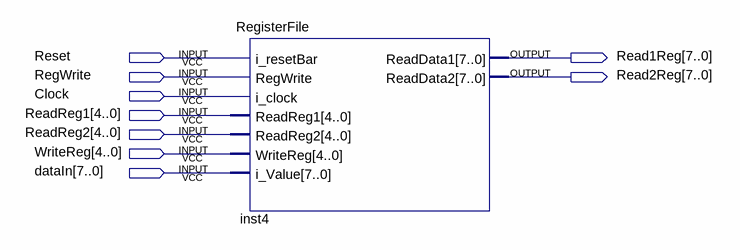
[diagram p0: schematic sheet]
// Quartus schematic test.bdf as structural Verilog: 1 symbols, 9 pins
module test (
  input  Reset,
  input  RegWrite,
  input  Clock,
  input  [4:0] ReadReg1,
  input  [4:0] ReadReg2,
  input  [4:0] WriteReg,
  input  [7:0] dataIn,
  output [7:0] Read1Reg,
  output [7:0] Read2Reg
);

  RegisterFile inst4 (
    .i_resetBar(Reset), .RegWrite(RegWrite), .i_clock(Clock), .ReadReg1(ReadReg1), .ReadReg2(ReadReg2),
    .WriteReg(WriteReg), .i_Value(dataIn), .ReadData1(Read1Reg), .ReadData2(Read2Reg));
endmodule
